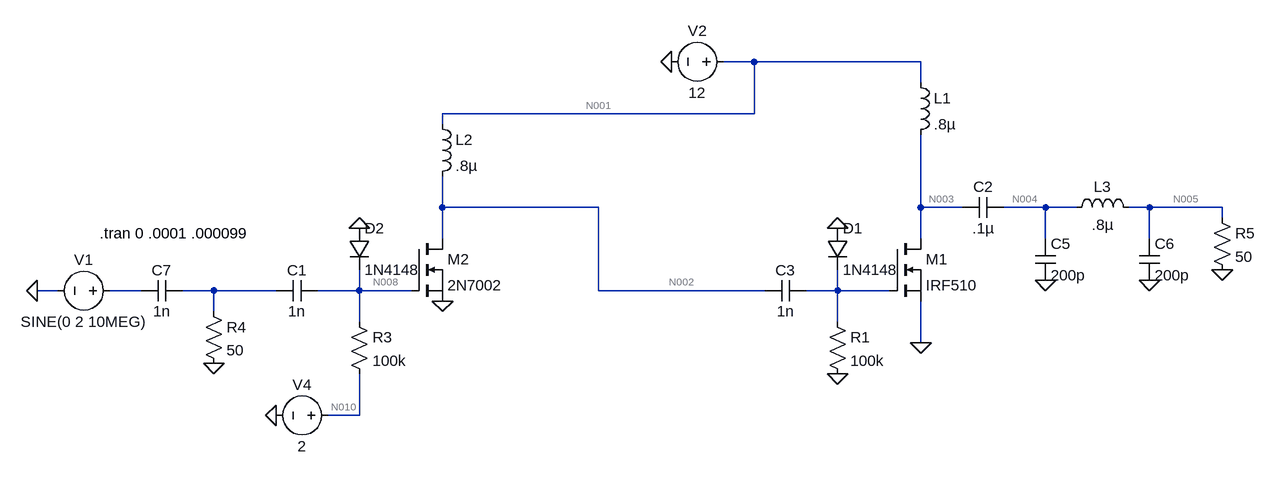
[diagram p0: schematic Draft2.asc]
Draft2.asc, the LTspice schematic file:
Version 4
SHEET 1 880 680
WIRE -16 -144 -64 -144
WIRE 240 -144 -16 -144
WIRE 240 -112 240 -144
WIRE -16 -64 -16 -144
WIRE -16 -64 -496 -64
WIRE -496 -48 -496 -64
WIRE -496 80 -496 32
WIRE -256 80 -496 80
WIRE 240 80 240 -32
WIRE 304 80 240 80
WIRE 432 80 368 80
WIRE 480 80 432 80
WIRE 592 80 560 80
WIRE 704 80 592 80
WIRE 704 96 704 80
WIRE -496 128 -496 80
WIRE 240 128 240 80
WIRE 432 128 432 80
WIRE 592 128 592 80
WIRE -1088 208 -1120 208
WIRE -960 208 -1008 208
WIRE -848 208 -896 208
WIRE -752 208 -848 208
WIRE -624 208 -624 176
WIRE -624 208 -688 208
WIRE -544 208 -624 208
WIRE -256 208 -256 80
WIRE 0 208 -256 208
WIRE 112 208 112 176
WIRE 112 208 64 208
WIRE 192 208 112 208
WIRE -848 240 -848 208
WIRE -624 256 -624 208
WIRE 112 256 112 208
WIRE 240 288 240 224
WIRE -624 400 -624 336
WIRE -624 400 -672 400
FLAG -1120 208 0
FLAG -144 -144 0
FLAG -752 400 0
FLAG -496 224 0
FLAG 112 112 0
FLAG 240 288 0
FLAG 432 192 0
FLAG 592 192 0
FLAG 704 176 0
FLAG 112 336 0
FLAG -624 112 0
FLAG -848 320 0
SYMBOL nmos 192 128 R0
SYMATTR InstName M1
SYMATTR Value IRF510
SYMBOL voltage -992 208 R90
WINDOW 0 -32 56 VBottom 2
WINDOW 3 32 56 VTop 2
WINDOW 123 0 0 Left 0
WINDOW 39 0 0 Left 0
SYMATTR InstName V1
SYMATTR Value SINE(0 2 10MEG)
SYMBOL voltage -48 -144 R90
WINDOW 0 -32 56 VBottom 2
WINDOW 3 32 56 VTop 2
WINDOW 123 0 0 Left 0
WINDOW 39 0 0 Left 0
SYMATTR InstName V2
SYMATTR Value 12
SYMBOL cap -688 192 R90
WINDOW 0 0 32 VBottom 2
WINDOW 3 32 32 VTop 2
SYMATTR InstName C1
SYMATTR Value 1n
SYMBOL cap 368 64 R90
WINDOW 0 0 32 VBottom 2
WINDOW 3 32 32 VTop 2
SYMATTR InstName C2
SYMATTR Value .1µ
SYMBOL ind 224 -128 R0
SYMATTR InstName L1
SYMATTR Value .8µ
SYMBOL res 96 240 R0
SYMATTR InstName R1
SYMATTR Value 100k
SYMBOL cap 64 192 R90
WINDOW 0 0 32 VBottom 2
WINDOW 3 32 32 VTop 2
SYMATTR InstName C3
SYMATTR Value 1n
SYMBOL nmos -544 128 R0
SYMATTR InstName M2
SYMATTR Value 2N7002
SYMBOL res -640 240 R0
SYMATTR InstName R3
SYMATTR Value 100k
SYMBOL voltage -656 400 R90
WINDOW 0 -32 56 VBottom 2
WINDOW 3 32 56 VTop 2
WINDOW 123 0 0 Left 0
WINDOW 39 0 0 Left 0
SYMATTR InstName V4
SYMATTR Value 2
SYMBOL ind -512 -64 R0
SYMATTR InstName L2
SYMATTR Value .8µ
SYMBOL diode 96 112 R0
SYMATTR InstName D1
SYMATTR Value 1N4148
SYMBOL cap 416 128 R0
SYMATTR InstName C5
SYMATTR Value 200p
SYMBOL ind 464 96 R270
WINDOW 0 32 56 VTop 2
WINDOW 3 5 56 VBottom 2
SYMATTR InstName L3
SYMATTR Value .8µ
SYMBOL cap 576 128 R0
SYMATTR InstName C6
SYMATTR Value 200p
SYMBOL res 688 80 R0
SYMATTR InstName R5
SYMATTR Value 50
SYMBOL diode -640 112 R0
SYMATTR InstName D2
SYMATTR Value 1N4148
SYMBOL cap -896 192 R90
WINDOW 0 0 32 VBottom 2
WINDOW 3 32 32 VTop 2
SYMATTR InstName C7
SYMATTR Value 1n
SYMBOL res -864 224 R0
SYMATTR InstName R4
SYMATTR Value 50
TEXT -1024 120 Left 2 !.tran 0 .0001 .000099

The netlist it stands for:
* Draft2.asc
M1 N003 N009 0 0 IRF510
V1 N006 0 SINE(0 2 10MEG)
V2 N001 0 12
C1 N008 N007 1n
C2 N004 N003 .1µ
L1 N001 N003 .8µ
R1 N009 0 100k
C3 N009 N002 1n
M2 N002 N008 0 0 2N7002
R3 N008 N010 100k
V4 N010 0 2
L2 N001 N002 .8µ
D1 0 N009 1N4148
C5 N004 0 200p
L3 N004 N005 .8µ
C6 N005 0 200p
R5 N005 0 50
D2 0 N008 1N4148
C7 N007 N006 1n
R4 N007 0 50
.model D D
.lib standard.dio
.model NMOS NMOS
.model PMOS PMOS
.lib standard.mos
.tran 0 .0001 .000099
.backanno
.end

* Results of the author's LTspice run, read from the files saved beside the schematic
* Operating Point, zero values left out:
*   V(n003) = 12 V
*   V(n001) = 12 V
*   V(n008) = 2 V
*   V(n002) = 12 V
*   V(n010) = 2 V
*   Id(M2) = 13.06 mA
*   Is(M2) = -13.06 mA
*   Id(M1) = 29 pA
*   Is(M1) = -29 pA
*   I(D2) = -2.522 nA
*   I(L2) = 13.06 mA
*   I(L1) = 40.86 pA
*   I(R3) = -2.522 nA
*   I(V4) = -2.522 nA
*   I(V2) = -13.06 mA
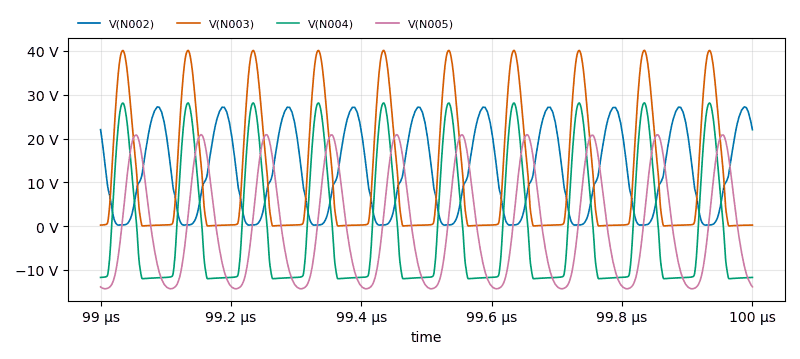
[diagram p1: Transient Analysis of Draft2.asc, plotted from the saved traces]
* Transient Analysis, 1 run:
*   V(N002): min 238 mV, max 27.24 V, average 11.94 V, rms 15.47 V, last 22.02 V
*   V(N003): min 32.22 mV, max 40.13 V, average 12 V, rms 19.04 V, last 239.5 mV
*   V(N004): min -12.01 V, max 28.13 V, average -2.507 mV, rms 14.79 V, last -11.72 V
*   V(N005): min -14.32 V, max 20.88 V, average 26.48 mV, rms 12.68 V, last -13.87 V